# EAGLE schematic rc (EAGLE 9.6.2)
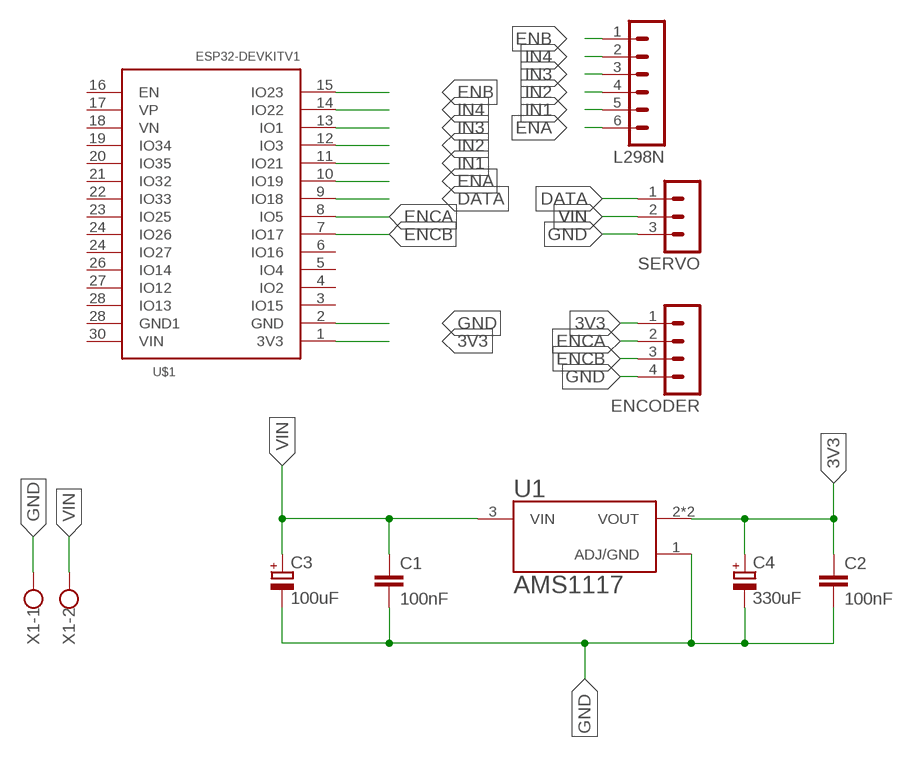
[diagram p0: schematic, sheet 1]

## Parts
C1  100nF  C-EUC0805  [C0805]
C2  100nF  C-EUC0805  [C0805]
C3  100uF  CPOL-EUCT6032  [CT6032]
C4  330uF  CPOL-EUCT6032  [CT6032]
ENCODER  MA04-1  [MA04-1]
L298N  MA06-1  [MA06-1]
SERVO  MA03-1  [MA03-1]
U1  AMS1117  [SOT229P700X180-4N]
U$1  ESP32DEVKITV1  [ESP32-DEVKITV1]
X1  W237-102  [W237-102]

## Nets
3V3: C2.1 C4.+ ENCODER.1 U1.2(VOUT) U1.4(VOUT) U$1.1(3V3)
DATA: SERVO.1 U$1.9(IO18)
ENA: L298N.6 U$1.10(IO19)
ENB: L298N.1 U$1.15(IO23)
ENCA: ENCODER.2 U$1.8(IO5)
ENCB: ENCODER.3 U$1.7(IO17)
GND: C1.2 C2.2 C3.- C4.- ENCODER.4 SERVO.3 U1.1(ADJ/GND) U$1.2(GND) X1.1
IN1: L298N.5 U$1.11(IO21)
IN2: L298N.4 U$1.12(IO3)
IN3: L298N.3 U$1.13(IO1)
IN4: L298N.2 U$1.14(IO22)
VIN: C1.1 C3.+ SERVO.2 U1.3(VIN) X1.2
Unconnected: U$1.3(IO15) U$1.4(IO2) U$1.5(IO4) U$1.6(IO16) U$1.16(EN) U$1.17(VP) U$1.18(VN) U$1.19(IO34) U$1.20(IO35) U$1.21(IO32) U$1.22(IO33) U$1.23(IO25) U$1.24(IO26) U$1.24(IO27) U$1.26(IO14) U$1.27(IO12) U$1.28(GND1) U$1.28(IO13) U$1.30(VIN)

## Library data of the parts
C1 C2 = rcl:C-EU: CAPACITOR, European symbol; SPICEPREFIX: C
C3 C4 = rcl:CPOL-EU: POLARIZED CAPACITOR, European symbol; SPICEPREFIX: C
ENCODER = con-lstb:MA04-1: PIN HEADER; OC_FARNELL: unknown; OC_NEWARK: unknown
L298N = con-lstb:MA06-1: PIN HEADER; OC_FARNELL: unknown; OC_NEWARK: unknown
SERVO = con-lstb:MA03-1: PIN HEADER; OC_FARNELL: unknown; OC_NEWARK: unknown
U1 = AMS1117:AMS1117: Sot223/Pkg 1-Amp 5-Volt Low Drop Out Voltage Regulatator Check prices <https://pricing.snapeda.com/parts/AMS1117/Advanced%20Monolithic%20Systems/view-part?ref=eda>; AVAILABILITY: No availability data; DESCRIPTION: 1A LOW DROPOUT VOLTAGE REGULATOR SOT-223; MF: Advanced Monolithic Systems; MP: AMS1117; PACKAGE: SOT-223 Seeed Technology; PRICE: None
U$1 = ESP32-DEVKITV1:ESP32DEVKITV1
X1 = con-wago-500:W237-102: WAGO SCREW CLAMP; MPN: 237-102; OC_FARNELL: unknown; OC_NEWARK: 70K9898